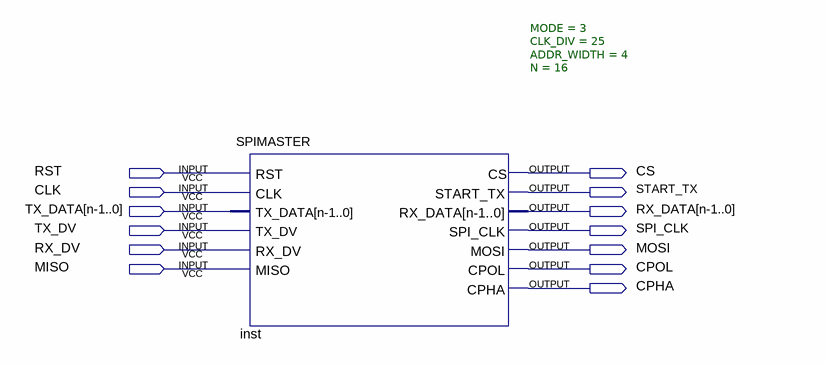
[diagram p0: schematic sheet]
// Quartus schematic Block1.bdf as structural Verilog: 1 symbols, 13 pins
module Block1 (
  input  RST,
  input  CLK,
  input  \TX_DATA[n-1..0] ,
  input  TX_DV,
  input  RX_DV,
  input  MISO,
  output CS,
  output START_TX,
  output \RX_DATA[n-1..0] ,
  output SPI_CLK,
  output MOSI,
  output CPOL,
  output CPHA
);

  SPIMASTER #(.MODE(3), .CLK_DIV(25), .ADDR_WIDTH(4), .N(16)) inst (
    .RST(RST), .CLK(CLK), .TX_DATA({16{\TX_DATA[n-1..0] }}), .TX_DV(TX_DV), .RX_DV(RX_DV), .MISO(MISO),
    .CS(CS), .START_TX(START_TX), .RX_DATA(\RX_DATA[n-1..0] ), .SPI_CLK(SPI_CLK), .MOSI(MOSI), .CPOL(CPOL),
    .CPHA(CPHA));
endmodule
